# EAGLE design RCMega128 (EAGLE 4.11)
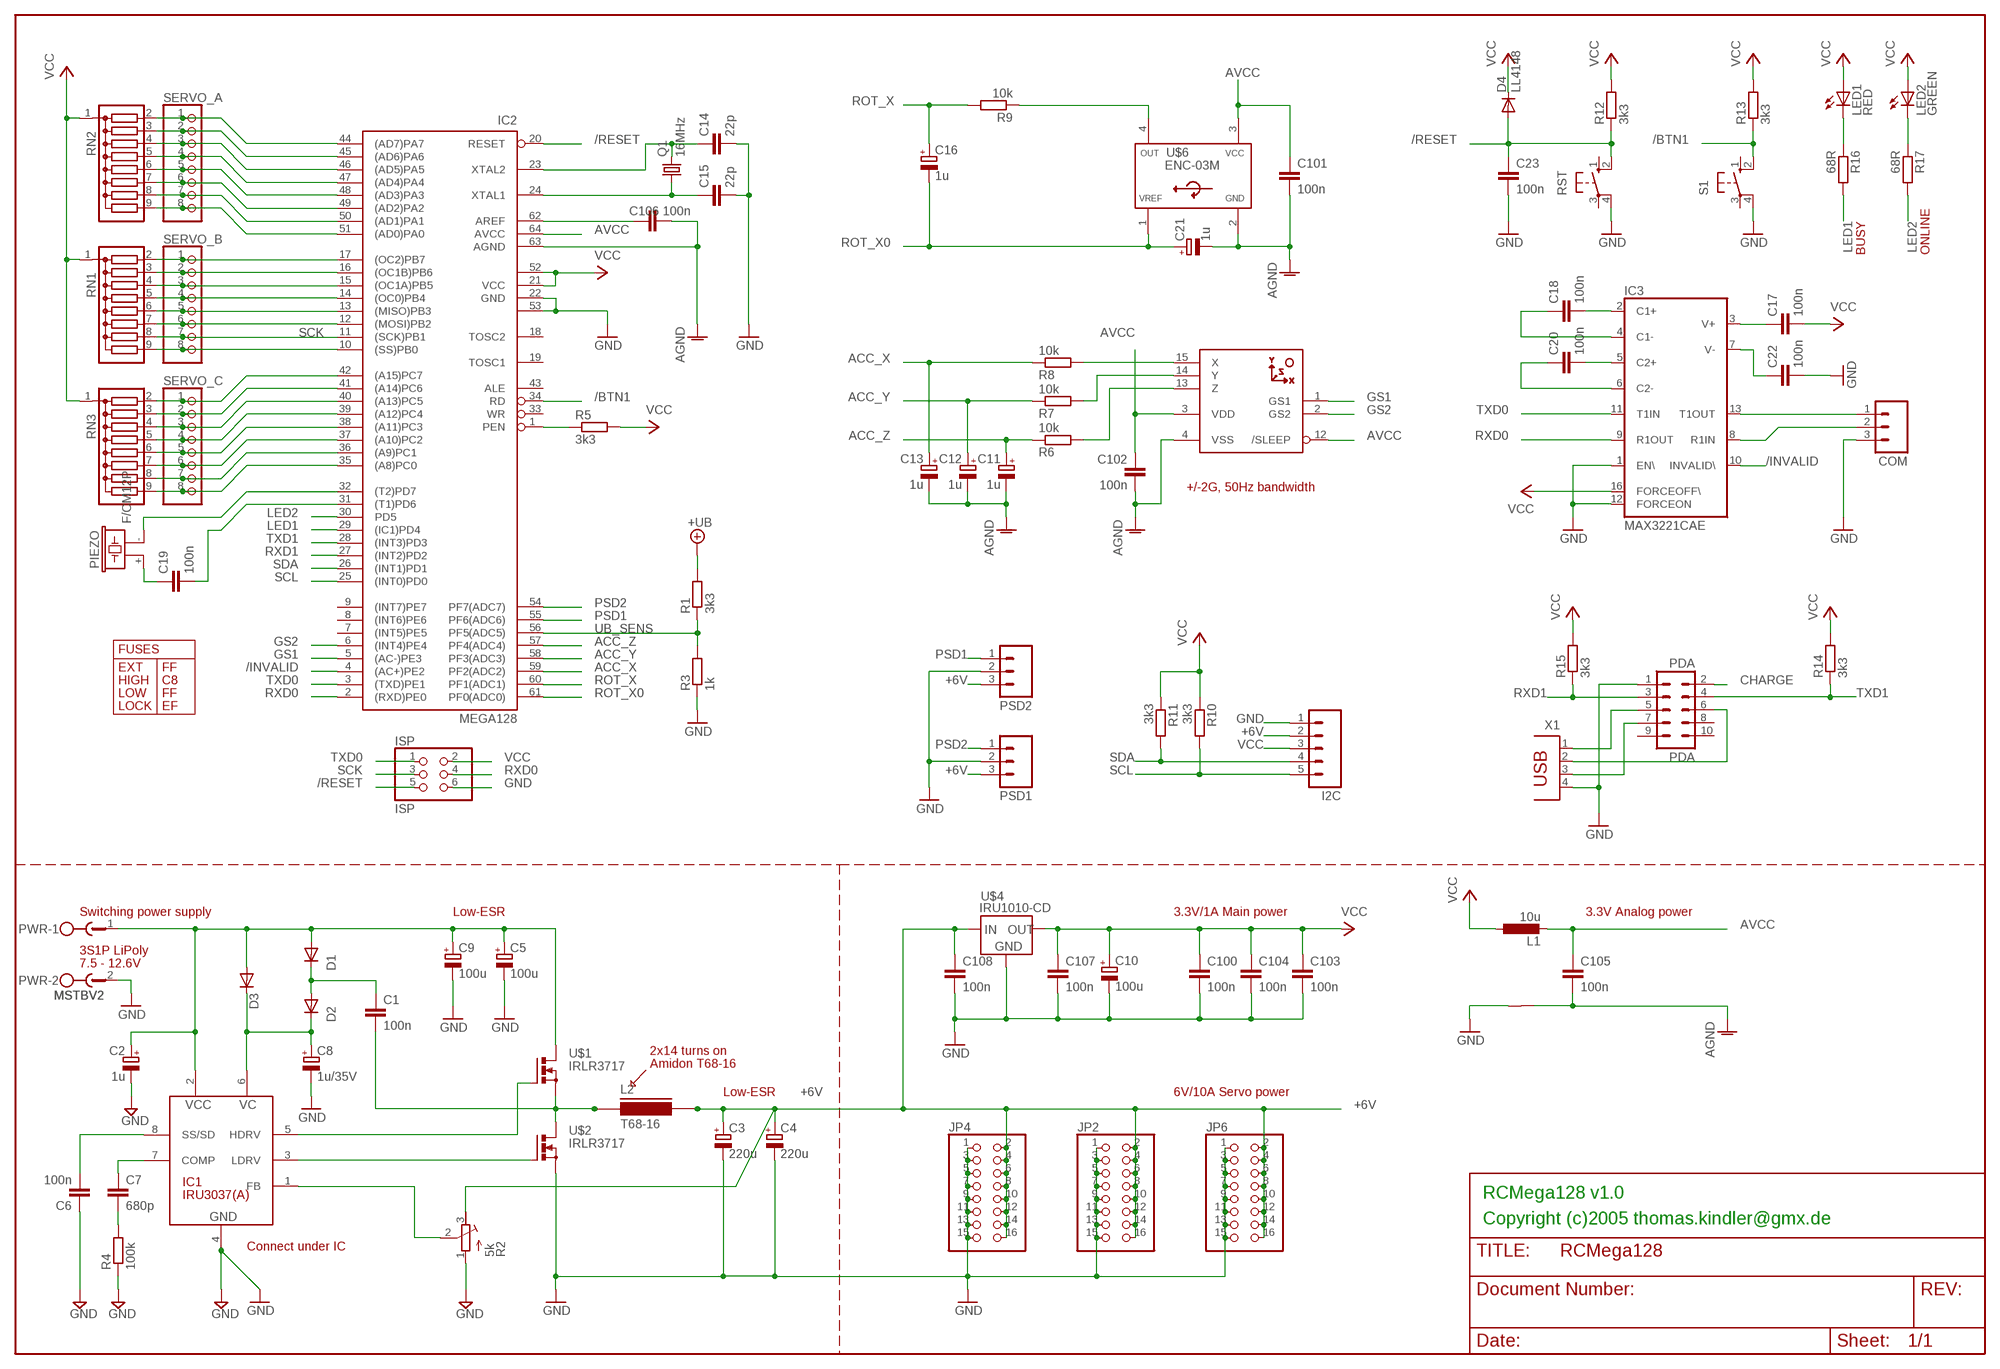
[diagram p0: schematic, sheet 1]

## Parts
C1  100n  C-EUC0805  [C0805]
C2  1u  CPOL-EUCT3528  [CT3528]
C3  220u  CPOL-EUD/7343-31R  [D/7343-31R]
C4  220u  CPOL-EUD/7343-31R  [D/7343-31R]
C5  100u  CPOL-EUD/7343-31R  [D/7343-31R]
C6  100n  C-EUC0805  [C0805]
C7  680p  C-EUC0805  [C0805]
C8  1u/35V  CPOL-EUCT3528  [CT3528]
C9  100u  CPOL-EUD/7343-31R  [D/7343-31R]
C10  100u  CPOL-EUD/7343-31R  [D/7343-31R]
C11  1u  CPOL-EUCT3528  [CT3528]
C12  1u  CPOL-EUCT3528  [CT3528]
C13  1u  CPOL-EUCT3528  [CT3528]
C14  22p  C-EUC0805  [C0805]
C15  22p  C-EUC0805  [C0805]
C16  1u  CPOL-EUCT3528  [CT3528]
C17  100n  C-EUC0805  [C0805]
C18  100n  C-EUC0805  [C0805]
C19  100n  C-EUC0805  [C0805]
C20  100n  C-EUC0805  [C0805]
C21  1u  CPOL-EUCT3528  [CT3528]
C22  100n  C-EUC0805  [C0805]
C23  100n  C-EUC0805  [C0805]
C100  100n  C-EUC0805  [C0805]
C101  100n  C-EUC0805  [C0805]
C102  100n  C-EUC0805  [C0805]
C103  100n  C-EUC0805  [C0805]
C104  100n  C-EUC0805  [C0805]
C105  100n  C-EUC0805  [C0805]
C106  100n  C-EUC0805  [C0805]
C107  100n  C-EUC0805  [C0805]
C108  100n  C-EUC0805  [C0805]
COM  M03  [03P]
D1  DIODE-SOD80C  [SOD80C]
D2  DIODE-SOD80C  [SOD80C]
D3  DIODE-SOD80C  [SOD80C]
D4  LL4148  DIODE-SOD80C  [SOD80C]
I2C  M05  [05P]
IC1  IRU3037(A)  [SO08]
IC2  MEGA128  MEGA103  [TQFP64]
IC3  MAX3221CAE  [SSOP16]
ISP  ISP  PINHD-2X3  [2X03]
JP2  PINHD-2X8  [2X08]
JP4  PINHD-2X8  [2X08]
JP6  PINHD-2X8  [2X08]
L1  10u  L-EUL2012C  [L2012C]
L2  T68-16  [T68-16]
LED1  RED  LEDCHIP-LED0805  [CHIP-LED0805]
LED2  GREEN  LEDCHIP-LED0805  [CHIP-LED0805]
PDA  PDA  ML10  [ML10]
PIEZO  F/CM12P  [F/CM12P]
PSD1  M03  [03P]
PSD2  M03  [03P]
PWR  MSTBV2  [MSTBV2]
Q1  16MHz  CRYTALHC49S  [HC49/S]
R1  3k3  R-EU_R0805  [R0805]
R2  5k  R-TRIMM5X  [RTRIM5X]
R3  1k  R-EU_R0805  [R0805]
R4  100k  R-EU_M0805  [M0805]
R5  3k3  R-EU_R0805  [R0805]
R6  10k  R-EU_R0805  [R0805]
R7  10k  R-EU_R0805  [R0805]
R8  10k  R-EU_R0805  [R0805]
R9  10k  R-EU_R0805  [R0805]
R10  3k3  R-EU_R0805  [R0805]
R11  3k3  R-EU_R0805  [R0805]
R12  3k3  R-EU_R0805  [R0805]
R13  3k3  R-EU_R0805  [R0805]
R14  3k3  R-EU_R0805  [R0805]
R15  3k3  R-EU_R0805  [R0805]
R16  68R  R-EU_R0805  [R0805]
R17  68R  R-EU_R0805  [R0805]
RN1  G08R  [SIL9]
RN2  G08R  [SIL9]
RN3  G08R  [SIL9]
RST  10-XX  [B3F-10XX]
S1  10-XX  [B3F-10XX]
SERVO_A  PINHD-1X8  [1X08]
SERVO_B  PINHD-1X8  [1X08]
SERVO_C  PINHD-1X8  [1X08]
U$1  IRLR3717  [D-PAK]
U$2  IRLR3717  [D-PAK]
U$4  IRU1010-CD  [D-PAK]
U$5  MMA7260Q  [16LEADQFN]
U$6  ENC-03M  [GYROSTAR]
U$100  0R  [0R]
X1  PN61729  [PN61729]

## Nets
+6V: C3.+ C4.+ C108.1 I2C.2 JP2.2 JP2.4 JP2.6 JP2.8 JP2.10 JP2.12 JP2.14 JP2.16 JP4.2 JP4.4 JP4.6 JP4.8 JP4.10 JP4.12 JP4.14 JP4.16 JP6.2 JP6.4 JP6.6 JP6.8 JP6.10 JP6.12 JP6.14 JP6.16 L2.P$1 L2.P$2 PSD1.3 PSD2.3 R2.3(A) U$4.3(IN)
+UB: C2.+ C5.+ C9.+ D1.A D3.A IC1.2(VCC) PWR.1 R1.2 U$1.4(D)
/BTN1: IC2.34(RD) R13.1 S1.2(S1)
/INVALID: IC2.4((AC+)PE2) IC3.10(INVALID\)
/RESET: C23.1 D4.A IC2.20(RESET) ISP.5 R12.1 RST.2(S1)
ACC_X: C13.+ IC2.59(PF2(ADC2)) R8.1
ACC_Y: C12.+ IC2.58(PF3(ADC3)) R7.1
ACC_Z: C11.+ IC2.57(PF4(ADC4)) R6.1
AGND: C11.- C12.- C13.- C21.- C101.2 C102.2 C105.2 C106.2 IC2.63(AGND) U$5.4(VSS) U$6.2(GND) U$100.P$2
AREF: C106.1 IC2.62(AREF)
AVCC: C101.1 C102.1 C105.1 IC2.64(AVCC) L1.2 U$5.3(VDD) U$5.12(/SLEEP) U$6.3(VCC)
CHARGE: PDA.2
GND: C2.- C3.- C4.- C5.- C6.1 C8.- C9.- C10.- C14.2 C15.2 C22.2 C23.2 C100.2 C103.2 C104.2 C107.2 C108.2 COM.3 I2C.1 IC1.4(GND) IC2.22(GND) IC2.53(GND1) IC3.1(EN\) IC3.12(FORCEON) ISP.6 JP2.1 JP2.3 JP2.5 JP2.7 JP2.9 JP2.11 JP2.13 JP2.15 JP4.1 JP4.3 JP4.5 JP4.7 JP4.9 JP4.11 JP4.13 JP4.15 JP6.1 JP6.3 JP6.5 JP6.7 JP6.9 JP6.11 JP6.13 JP6.15 PDA.1 PSD1.2 PSD2.2 PWR.2 R2.1(E) R3.1 R4.1 RST.4(P1) S1.4(P1) U$2.3(S) U$4.1(GND) U$100.P$1 X1.4
GS1: IC2.5((AC-)PE3) U$5.1(GS1)
GS2: IC2.6((INT4)PE4) U$5.2(GS2)
HDRV: IC1.5(HDRV) U$1.1(G)
LDRV: IC1.3(LDRV) U$2.1(G)
LED1: IC2.29((IC1)PD4) R16.2
LED2: IC2.30(PD5) R17.2
N$2: R6.2 U$5.13(Z)
N$3: R9.1 U$6.4(OUT)
N$4: LED1.C R16.1
N$5: LED2.C R17.1
N$6: C14.1 IC2.23(XTAL2) Q1.2
N$7: C15.1 IC2.24(XTAL1) Q1.1
N$10: C18.2 IC3.2(C1+)
N$11: C18.1 IC3.4(C1-)
N$12: C20.2 IC3.5(C2+)
N$13: C20.1 IC3.6(C2-)
N$14: C17.1 IC3.3(V+)
N$15: IC2.1(PEN) R5.1
N$16: C22.1 IC3.7(V-)
N$19: COM.1 IC3.13(T1OUT)
N$20: COM.2 IC3.8(R1IN)
N$23: R7.2 U$5.14(Y)
N$24: R8.2 U$5.15(X)
N$25: C1.2 L2.P$3 L2.P$4 U$1.3(S) U$2.4(D)
N$26: C19.1 PIEZO.+
N$29: IC2.32((T2)PD7) PIEZO.-
N$31: IC1.1(FB) R2.2(S)
N$32: C1.1 D1.C D2.A
N$33: C7.1 IC1.7(COMP)
N$35: C7.2 R4.2
N$37: C6.2 IC1.8(SS/SD)
N$38: C19.2 IC2.31((T1)PD6)
PSD1: IC2.55(PF6(ADC6)) PSD2.1
PSD2: IC2.54(PF7(ADC7)) PSD1.1
ROT_X: C16.+ IC2.60(PF1(ADC1)) R9.2
ROT_X0: C16.- C21.+ IC2.61(PF0(ADC0)) U$6.1(VREF)
RXD0: IC2.2((RXD)PE0) IC3.9(R1OUT) ISP.4
RXD1: IC2.27((INT2)PD2) PDA.3 R15.1
S0: IC2.44((AD7)PA7) RN2.2 SERVO_A.1
S1: IC2.45((AD6)PA6) RN2.3 SERVO_A.2
S2: IC2.46((AD5)PA5) RN2.4 SERVO_A.3
S3: IC2.47((AD4)PA4) RN2.5 SERVO_A.4
S4: IC2.48((AD3)PA3) RN2.6 SERVO_A.5
S5: IC2.49((AD2)PA2) RN2.7 SERVO_A.6
S6: IC2.50((AD1)PA1) RN2.8 SERVO_A.7
S7: IC2.51((AD0)PA0) RN2.9 SERVO_A.8
S8: IC2.17((OC2)PB7) RN1.2 SERVO_B.1
S9: IC2.16((OC1B)PB6) RN1.3 SERVO_B.2
S10: IC2.15((OC1A)PB5) RN1.4 SERVO_B.3
S11: IC2.14((OC0)PB4) RN1.5 SERVO_B.4
S12: IC2.12((MOSI)PB2) RN1.7 SERVO_B.6
S14: IC2.10((SS)PB0) RN1.9 SERVO_B.8
S15: IC2.13((MISO)PB3) RN1.6 SERVO_B.5
S16: IC2.42((A15)PC7) RN3.2 SERVO_C.1
S17: IC2.41((A14)PC6) RN3.3 SERVO_C.2
S18: IC2.40((A13)PC5) RN3.4 SERVO_C.3
S19: IC2.39((A12)PC4) RN3.5 SERVO_C.4
S20: IC2.37((A10)PC2) RN3.7 SERVO_C.6
S21: IC2.36((A9)PC1) RN3.8 SERVO_C.7
S22: IC2.35((A8)PC0) RN3.9 SERVO_C.8
S23: IC2.38((A11)PC3) RN3.6 SERVO_C.5
SCK: IC2.11((SCK)PB1) ISP.3 RN1.8 SERVO_B.7
SCL: I2C.5 IC2.25((INT0)PD0) R10.2
SDA: I2C.4 IC2.26((INT1)PD1) R11.2
TXD0: IC2.3((TXD)PE1) IC3.11(T1IN) ISP.1
TXD1: IC2.28((INT3)PD3) PDA.4 R14.1
UB_SENS: IC2.56(PF5(ADC5)) R1.1 R3.2
USB_D+: PDA.7 X1.3
USB_D-: PDA.6 X1.2
USB_VBUS: PDA.5 X1.1
VC: C8.+ D2.C D3.C IC1.6(VC)
VCC: C10.+ C17.2 C100.1 C103.1 C104.1 C107.1 D4.C I2C.3 IC2.21(VCC) IC2.52(VCC1) IC3.16(FORCEOFF\) ISP.2 L1.1 LED1.A LED2.A R5.2 R10.1 R11.1 R12.2 R13.2 R14.2 R15.2 RN1.1 RN2.1 RN3.1 U$4.4(OUT)
Unconnected: IC2.7((INT5)PE5) IC2.8((INT6)PE6) IC2.9((INT7)PE7) IC2.18(TOSC2) IC2.19(TOSC1) IC2.33(WR) IC2.43(ALE) PDA.8 PDA.9 PDA.10 RST.1(S) RST.3(P) S1.1(S) S1.3(P)

## Notes on the sheet
- ONLINE
- BUSY
- +/-2G, 50Hz bandwidth
- FUSES
- EXT | FF
- HIGH | C8
- LOW | FF
- LOCK | EF
- Switching power supply | Low-ESR | 3.3V/1A Main power | 3.3V Analog power
- 3S1P LiPoly
- 7.5 - 12.6V
- 2x14 turns on
- Amidon T68-16
- Low-ESR | 6V/10A Servo power
- RCMega128 v1.0
- Copyright (c)2005 thomas.kindler@gmx.de
- Connect under IC

## Power pins joined to a net without a drawn wire
GND: IC3.14(GND)
VCC: IC3.15(VCC)

## Library data of the parts
C1 C6 C7 C14 C15 C17-C20 C22 C23 C100-C108 = rcl:C-EU: CAPACITOR, European symbol
C2-C5 C8-C13 C16 C21 = rcl:CPOL-EU: POLARIZED CAPACITOR, European symbol
COM PSD1 PSD2 = con-amp-quick:M03: AMP QUICK CONNECTOR
D1-D4 = diode:DIODE-: DIODE
I2C = con-amp-quick:M05: AMP QUICK CONNECTOR
IC1 = special_parts:IRU3037(A)
IC2 = atmel:MEGA103*: MICROCONTROLLER Low-voltage (L) 128 Kbytes FLASH 4 Kbytes SRAM 2 Kbytes EEPROM UART RTC 8-channel 10 bit ADC
IC3 = maxim:MAX3221*: RS-232 Transceivers with AutoShutdown 1µA Supply-Current, True +3V to +5.5V http://dbserv.maxim-ic.com/
ISP = pinhead:PINHD-2X3: PIN HEADER
JP2 JP4 JP6 = pinhead:PINHD-2X8: PIN HEADER
L1 = rcl:L-EU: INDUCTOR, European symbol
L2 = special_parts:T68-16
LED1 LED2 = led:LED: LED OSRAM: - CHIPLED LG R971, LG N971, LY N971, LG Q971, LY Q971, LO R971, LY R971 LH N974, LH R974 LS Q976, LO Q976, LY Q976 LO Q996 - Hyper CHIPLED LW Q18S LB Q993, LB Q99A, LB R99A - SideLED LS A670, LO A670, LY A670, LG A670, LP A670 LB A673, LV A673, LT A673, LW A673 LH A674 LY A675 LS A676, LA A676, LO A676, LY A676, LW A676 LS A679, LY A679, LG A679 - Hyper Micro SIDELED® LS Y876, LA Y876, LO Y876, LY Y876 LT Y87S - SmartLED LW L88C, LW L88S LB L89C, LB L89S, LG L890 LS L89K, LO L89K, LY L89K LS L896, LA L896, LO L896, LY L896 - TOPLED LS T670, LO T670, LY T670, LG T670, LP T670 LSG T670, LSP T670, LSY T670, LOP T670, LYG T670 LG T671, LOG T671, LSG T671 LB T673, LV T673, LT T673, LW T673 LH T674 LS T676, LA T676, LO T676, LY T676, LB T676, LH T676, LSB T676, LW T676 LB T67C, LV T67C, LT T67C, LS T67K, LO T67K, LY T67K, LW E67C LS E67B, LA E67B, LO E67B, LY E67B, LB E67C, LV E67C, LT E67C LW T67C LS T679, LY T679, LG T679 LS T770, LO T770, LY T770, LG T770, LP T770 LB T773, LV T773, LT T773, LW T773 LH T774 LS E675, LA E675, LY E675, LS T675 LS T776, LA T776, LO T776, LY T776, LB T776 LHGB T686 LT T68C, LB T68C - Hyper Mini TOPLED® LB M676 - Mini TOPLED Santana® LG M470 LS M47K, LO M47K, LY M47K Source: http://www.osram.convergy.de/
PDA = con-harting-ml:ML10: HARTING
PIEZO = buzzer:F/CM12P: BUZZER Source: Buerklin
PWR = con-phoenix-508:MSTBV2: PHOENIX
Q1 = crystal:CRYTAL: CRYSTAL
R1 R3-R17 = rcl:R-EU_: RESISTOR, European symbol
R2 = rcl:R-TRIMM: Trimm resistor
RN1-RN3 = special_parts:G08R: SIL RESISTOR
RST S1 = switch-omron:10-XX: OMRON SWITCH
SERVO_A SERVO_B SERVO_C = pinhead_oct:PINHD-1X8: PIN HEADER
U$1 U$2 = special_parts:IRLR3717
U$4 = special_parts:IRU1010-CD
U$5 = special_parts:MMA7260Q
U$6 = special_parts:ENC-03M
U$100 = special_parts:0R
X1 = special_parts:PN61729: BERG USB connector

## Board
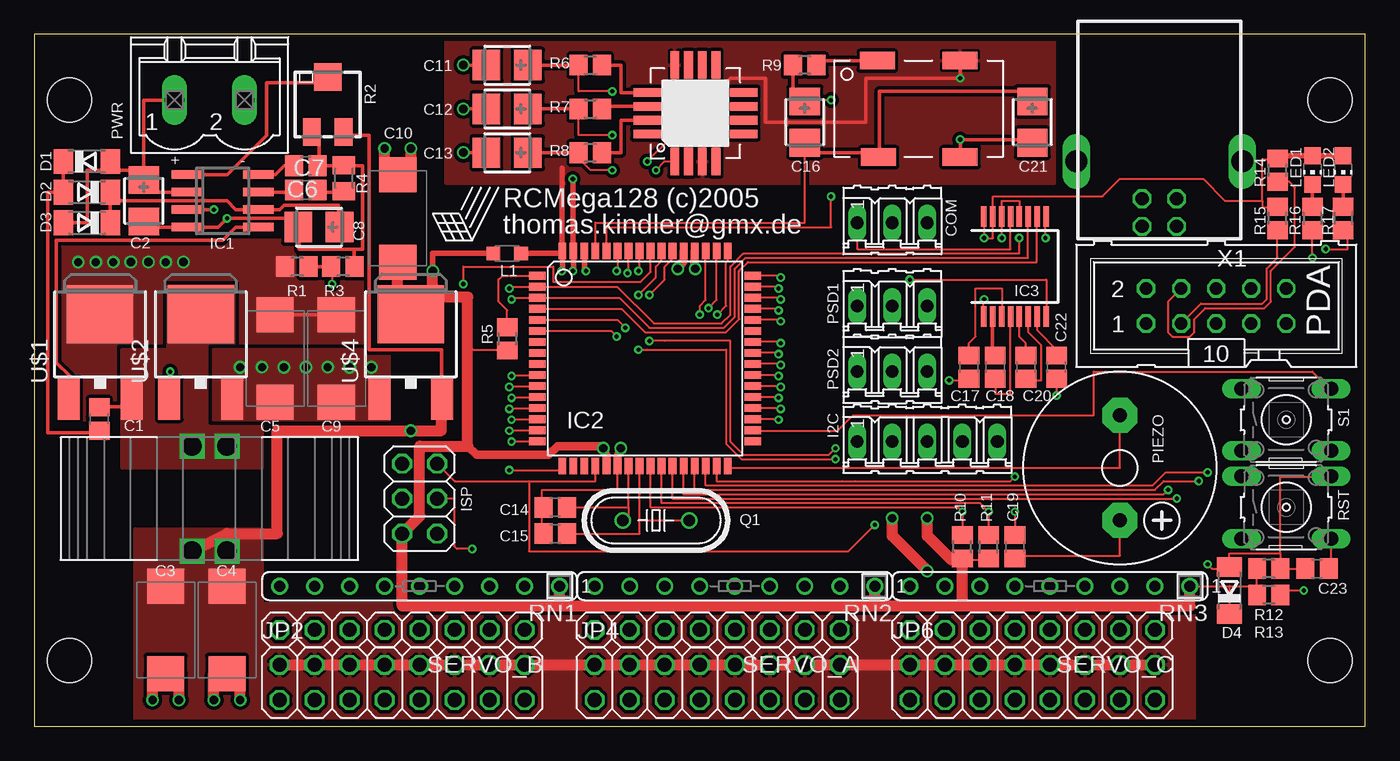
[diagram p1: board, top side]
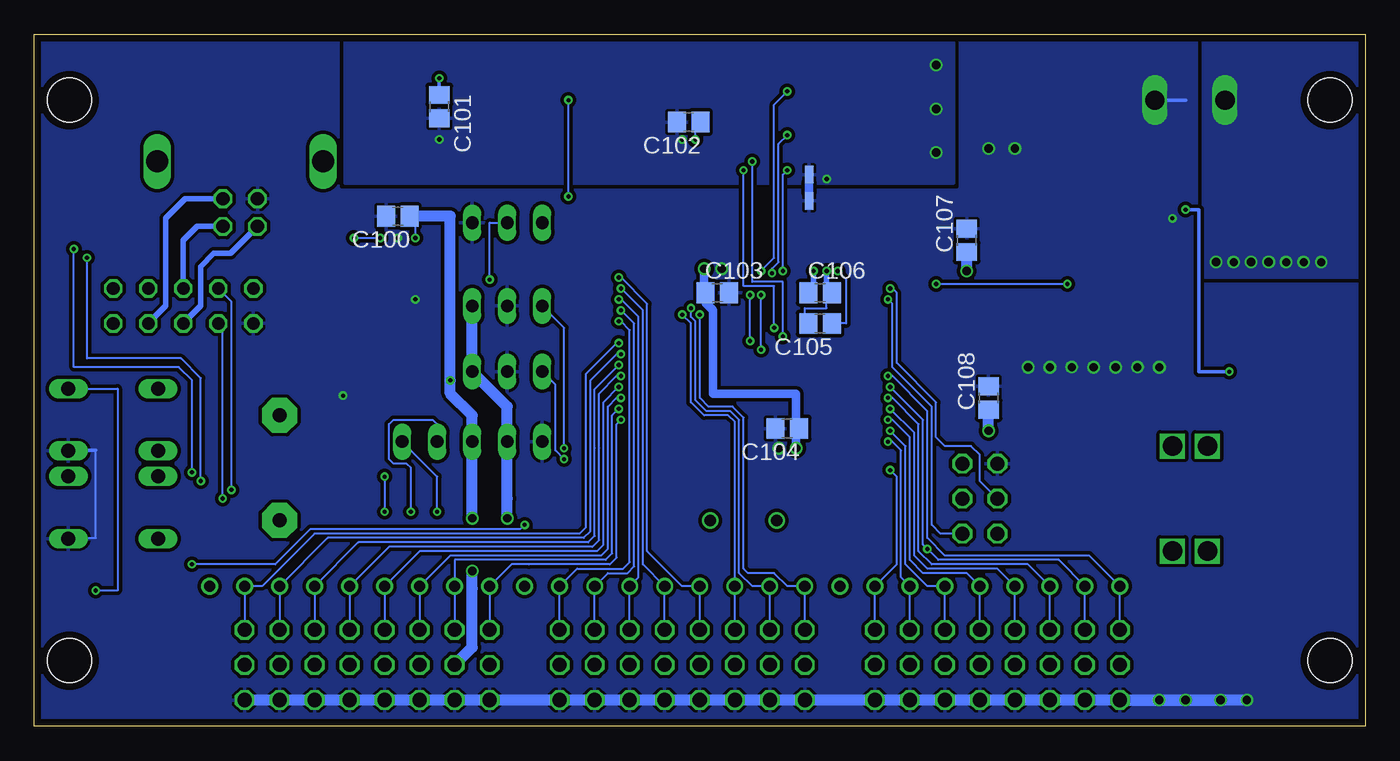
[diagram p2: board, bottom side, seen from below]

Size 96.52 x 50.16 mm. Coordinates in mm from the lower left corner, seen from the top.
Outline: 0,0 96.52,0 96.52,50.16 0,50.16 0,0
Copper layers (1*16): Top 0.035mm / dielectric 1.5mm / Bottom 0.035mm
Design rules "PCB-POOL": minimum track width 6mil, minimum drill 12mil, track to track 6mil, track to pad 6mil, pad to pad 6mil, via to via 6mil, smd to smd 6mil, copper to edge 20mil, drill to drill 8mil, minimum pad ring 8mil, minimum via ring 6mil, stop-mask expansion 3mil, vias tented up to drill 0mil, thermal gap 8mil
Holes 3.2 mm at 2.54,45.4 2.54,4.76 93.98,4.76 93.98,45.4

### Footprints (pad centres in the part's own frame; a part is rotated, then mirrored left to right if it is on the bottom)
C0805 = smd 1.3 x 1.5: 1 -0.85,0; 2 0.85,0
CT3528 = smd 2 x 2.2: + 1.5,0; - -1.5,0
D/7343-31R = smd 2.55 x 2.7: + 3.175,0; - -3.175,0
03P = drill 0.914 long: 1 -2.54,0; 2 0,0; 3 2.54,0
SOD80C = smd 1.4 x 1.8: A 1.7,0; C -1.7,0
05P = drill 0.914 long: 1 -5.08,0; 2 -2.54,0; 3 0,0; 4 2.54,0; 5 5.08,0
SO08 = smd 0.6 x 2.2: 1 -1.905,-2.6; 2 -0.635,-2.6; 3 0.635,-2.6; 4 1.905,-2.6; 5 1.905,2.6; 6 0.635,2.6; 7 -0.635,2.6; 8 -1.905,2.6
TQFP64 = smd 1.194 x 0.559: 1 -7.8,6; 2 -7.8,5.2; 3 -7.8,4.4; 4 -7.8,3.6; 5 -7.8,2.8; 6 -7.8,2; 7 -7.8,1.2; 8 -7.8,0.4; 9 -7.8,-0.4; 10 -7.8,-1.2; 11 -7.8,-2; 12 -7.8,-2.8; 13 -7.8,-3.6; 14 -7.8,-4.4; 15 -7.8,-5.2; 16 -7.8,-6; 33 7.8,-6; 34 7.8,-5.2; 35 7.8,-4.4; 36 7.8,-3.6; 37 7.8,-2.8; 38 7.8,-2; 39 7.8,-1.2; 40 7.8,-0.4; 41 7.8,0.4; 42 7.8,1.2; 43 7.8,2; 44 7.8,2.8; 45 7.8,3.6; 46 7.8,4.4; 47 7.8,5.2; 48 7.8,6 | smd 0.559 x 1.194: 17 -6,-7.8; 18 -5.2,-7.8; 19 -4.4,-7.8; 20 -3.6,-7.8; 21 -2.8,-7.8; 22 -2,-7.8; 23 -1.2,-7.8; 24 -0.4,-7.8; 25 0.4,-7.8; 26 1.2,-7.8; 27 2,-7.8; 28 2.8,-7.8; 29 3.6,-7.8; 30 4.4,-7.8; 31 5.2,-7.8; 32 6,-7.8; 49 6,7.8; 50 5.2,7.8; 51 4.4,7.8; 52 3.6,7.8; 53 2.8,7.8; 54 2,7.8; 55 1.2,7.8; 56 0.4,7.8; 57 -0.4,7.8; 58 -1.2,7.8; 59 -2,7.8; 60 -2.8,7.8; 61 -3.6,7.8; 62 -4.4,7.8; 63 -5.2,7.8; 64 -6,7.8
SSOP16 = smd 0.4 x 1.5: 1 -2.275,-3.625; 2 -1.625,-3.625; 3 -0.975,-3.625; 4 -0.325,-3.625; 5 0.325,-3.625; 6 0.975,-3.625; 7 1.625,-3.625; 8 2.275,-3.625; 9 2.275,3.625; 10 1.625,3.625; 11 0.975,3.625; 12 0.325,3.625; 13 -0.325,3.625; 14 -0.975,3.625; 15 -1.625,3.625; 16 -2.275,3.625
2X03 = drill 1.016 octagon: 1 -2.54,-1.27; 2 -2.54,1.27; 3 0,-1.27; 4 0,1.27; 5 2.54,-1.27; 6 2.54,1.27
2X08 = drill 1.016 octagon: 1 -8.89,-1.27; 2 -8.89,1.27; 3 -6.35,-1.27; 4 -6.35,1.27; 5 -3.81,-1.27; 6 -3.81,1.27; 7 -1.27,-1.27; 8 -1.27,1.27; 9 1.27,-1.27; 10 1.27,1.27; 11 3.81,-1.27; 12 3.81,1.27; 13 6.35,-1.27; 14 6.35,1.27; 15 8.89,-1.27; 16 8.89,1.27
L2012C = smd 1 x 1: 1 -1,0; 2 1,0
T68-16 = drill 1.4 square: P$1 -3.81,1.27; P$2 -3.81,-1.27; P$3 3.81,1.27; P$4 3.81,-1.27
CHIP-LED0805 = smd 1.2 x 1.2: A 0,-1.05; C 0,1.05
ML10 = drill 0.914 octagon: 1 -5.08,-1.27; 2 -5.08,1.27; 3 -2.54,-1.27; 4 -2.54,1.27; 5 0,-1.27; 6 0,1.27; 7 2.54,-1.27; 8 2.54,1.27; 9 5.08,-1.27; 10 5.08,1.27
F/CM12P = drill 1.016 pad 2.54 octagon: + 3.81,0; - -3.81,0
MSTBV2 = drill 1.397 long: 1 -2.54,0; 2 2.54,0
HC49/S = drill 0.813 round: 1 -2.413,0; 2 2.413,0
R0805 = smd 1.3 x 1.5: 1 -0.85,0; 2 0.85,0
RTRIM5X = smd 1.3 x 2: 1 -1.15,-2; 3 1.15,-2 | smd 2 x 2: 2 0,2
M0805 = smd 1.3 x 1.6: 1 -0.95,0; 2 0.95,0
SIL9 = drill 0.813 round: 1 -10.16,0; 2 -7.62,0; 3 -5.08,0; 4 -2.54,0; 5 0,0; 6 2.54,0; 7 5.08,0; 8 7.62,0; 9 10.16,0
B3F-10XX = drill 1.016 long: 1 -3.251,2.261; 2 3.251,2.261; 3 -3.251,-2.261; 4 3.251,-2.261
1X08 = drill 1.016 octagon: 1 -8.89,0; 2 -6.35,0; 3 -3.81,0; 4 -1.27,0; 5 1.27,0; 6 3.81,0; 7 6.35,0; 8 8.89,0
D-PAK = smd 1.6 x 3: 1 -2.28,-4.04; 3 2.28,-4.04 | smd 4.826 x 4.191: 4 0,2.096
16LEADQFN = smd 2 x 0.635: 1 -3.5,1.5; 2 -3.5,0.5; 3 -3.5,-0.5; 4 -3.5,-1.5; 9 3.5,-1.5; 10 3.5,-0.5; 11 3.5,0.5; 12 3.5,1.5 | smd 0.635 x 2: 5 -1.5,-3.5; 6 -0.5,-3.5; 7 0.5,-3.5; 8 1.5,-3.5; 13 1.5,3.5; 14 0.5,3.5; 15 -0.5,3.5; 16 -1.5,3.5
GYROSTAR = smd 2.54 x 1.27: 1 -2.9,-3.5; 2 3,-3.5; 3 3,3.5; 4 -3,3.5
0R = smd 1.27 x 0.635: P$1 -0.953,0; P$2 0.953,0
PN61729 = drill 0.95 octagon: 1 1.25,4.71; 2 -1.25,4.71; 3 -1.25,2.71; 4 1.25,2.71 | drill 1.6 long: P$1 -6.032,0; P$2 6.033,0

### Placement (x,y rotation side)
C1  4.71,22.28 90 top
C2  7.94,38.1 90 top
C3  9.53,6.99 90 top
C4  13.97,6.99 90 top
C5  17.46,26.67 90 top
C6  19.68,40.64 180 top
C7  19.68,38.89 0 top
C8  20.64,36.2 0 top
C9  21.91,26.67 90 top
C10  26.35,36.83 270 top
C11  34.29,47.94 0 top
C12  34.29,44.77 0 top
C13  34.29,41.59 0 top
C14  37.78,15.88 180 top
C15  37.78,13.97 180 top
C16  55.88,43.81 90 top
C17  67.79,26.04 270 top
C18  69.69,26.04 90 top
C19  71.12,13.02 90 top
C20  71.91,26.04 90 top
C21  72.39,43.81 90 top
C22  74.14,26.04 270 top
C23  93.03,11.43 0 top
C100  70.17,36.99 180 bottom
C101  67.15,44.93 270 bottom
C102  49.05,43.81 180 bottom
C103  46.99,31.43 0 bottom
C104  41.91,21.59 180 bottom
C105  39.53,29.21 180 bottom
C106  39.53,31.43 0 bottom
C107  28.89,35.24 90 bottom
C108  27.31,23.81 90 bottom
COM  62.23,36.51 0 top
D1  3.8,40.96 0 top
D2  3.81,38.73 180 top
D3  3.81,36.51 180 top
D4  86.68,9.84 90 top
I2C  64.77,20.64 0 top
IC1  13.65,38.1 270 top
IC2  44.29,26.67 0 top
IC3  71.12,33.34 0 top
ISP  27.94,16.51 90 top
JP2  26.67,3.17 0 top
JP4  49.53,3.17 0 top
JP6  72.39,3.17 0 top
L1  34.29,34.29 0 top
L2  12.7,16.51 90 top
LED1  92.71,40.32 180 top
LED2  94.93,40.32 180 top
PDA  85.72,30.48 0 top
PIEZO  78.74,18.73 270 top
PSD1  62.23,30.48 0 top
PSD2  62.23,25.72 0 top
PWR  12.7,45.4 0 top
Q1  45.09,14.92 180 top
R1  19.05,33.34 180 top
R2  21.27,45.09 0 top
R3  22.38,33.34 180 top
R4  22.45,39.74 270 top
R5  34.29,28.1 270 top
R6  40.32,47.94 0 top
R7  40.32,44.77 0 top
R8  40.32,41.59 0 top
R9  55.88,47.94 180 top
R10  67.31,13.02 90 top
R11  69.22,13.02 90 top
R12  89.53,11.43 180 top
R13  89.53,9.53 180 top
R14  90.17,40.32 90 top
R15  90.17,36.83 90 top
R16  92.71,36.83 270 top
R17  94.93,36.83 270 top
RN1  27.94,10.16 180 top
RN2  50.8,10.16 180 top
RN3  73.66,10.16 180 top
RST  90.81,15.88 0 top
S1  90.81,22.23 0 top
SERVO_A  49.53,6.99 180 top
SERVO_B  26.67,6.99 180 top
SERVO_C  72.39,6.99 180 top
U$1  4.76,27.78 0 top
U$2  12.06,27.78 0 top
U$4  27.3,27.78 0 top
U$5  47.94,44.45 90 top
U$6  64.14,44.77 0 top
U$100  40.32,39.05 90 bottom
X1  81.6,40.96 180 top

### Tracks (layer width: path | path; a pad name or v marks a point on that pad's centre or on a via)
+6V  (via drill 0.61)
  Top 0.254: 13.97,9.84 C4.+ | U$4.3 29.53,23.58 29.53,27.3 26.35,27.3 | 26.35,27.3 | 26.35,27.3 24.29,27.3 24.29,42.86 22.54,42.86 22.54,43.09 R2.3
  Top 0.406: 29.53,23.74 U$4.3
  Top 0.813: JP2.2 JP2.4 JP2.6 JP2.8 | JP2.8 25.72,4.45 | JP2.8 JP2.10 JP2.12 JP2.14 JP2.16 JP4.2 JP4.4 JP4.6 JP4.8 JP4.10 JP4.12 JP4.14 JP4.16 JP6.2 JP6.4 JP6.6 JP6.8 | JP6.8 71.44,4.45 | JP6.8 JP6.10 JP6.12 JP6.14 JP6.16 | L2.P$1 13.97,13.97 17.62,13.97 17.62,21.43 v27.3,21.43 29.53,21.43 29.53,23.74 | v64.77,11.27 62.23,13.81 v62.23,15.08
  Bottom 0.813: PSD1.3 PSD2.3 62.23,23.18 I2C.2 62.23,16.51 v62.23,15.08 | 64.77,10 64.77,5.71 JP6.4 | 64.77,10 | 64.77,10 v64.77,11.27 | C108.1 | v27.3,21.43 C108.1
  pour Top (isolate 0.254, no thermals): 7.3,14.29 16.51,14.29 16.51,0 7.3,0
  pour Top (isolate 0.254): 16.51,8.89 84.14,8.89 84.14,0 16.51,0
+UB  (via drill 0.6, 0.61)
  Top 0.254: IC1.2 7.94,38.73 C2.+ 7.94,40.32 | 5.71,40.96 D1.A 5.5,40.43 5.4,40.32 | 5.4,40.32 3.81,40.32 3.81,36.51 D3.A | 5.4,40.32 7.94,40.32 | C9.+ C5.+ 16.51,29.84 | U$1.4 4.16,29.88 4.45,29.84 | 7.94,40.32 7.94,45.4 PWR.1
  other vias: 6.99,33.66 8.26,33.66 10.79,33.66 3.17,33.66 4.45,33.66 5.71,33.66 9.53,33.66
  pour Top (isolate 0.254, rank 6, no thermals): 0,35.24 23.81,35.24 23.81,22.23 0,22.23
  pour Bottom (isolate 0.254, rank 2, no thermals): 11.75,50.16 11.75,32.54 0,32.54 0,50.16
/BTN1  (via drill 0.3)
  Top 0.152: R13.1 90.39,9.84 v92.08,9.84 | IC2.34 52.19,21.47 52.39,21.43 58.26,21.43 58.74,21.91 59.37,22.54 76.83,22.54 76.83,25.72 92.71,25.72 93.98,24.49 | 93.98,24.49 93.98,24.45 | 93.98,24.49 S1.2
  Bottom 0.152: S1.2 90.49,24.49 90.49,9.84 v92.08,9.84
/INVALID
  Top 0.152: 51.12,33.02 51.75,33.66 72.71,33.66 72.71,34.29 72.71,36.51 IC3.10 | 51.12,33.02 | 51.12,33.02 51.12,29.53 50.16,28.57 44.29,28.57 42.6,30.27 IC2.4
/RESET  (via drill 0.3)
  Top 0.152: RST.2 94.06,18.1 90.39,18.1 90.39,12.54 | IC2.20 40.69,17.78 35.88,17.78 | 35.88,17.78 30.48,17.78 ISP.5 | C23.1 R12.1 90.39,12.54 | v60.96,14.61 59.05,12.7 35.88,12.7 35.88,17.78 | v85.09,11.75 85.41,11.43 86.68,11.43 D4.A 86.68,12.54 90.39,12.54
  Bottom 0.152: v60.96,14.61 61.28,14.29 76.52,14.29 79.06,11.75 v85.09,11.75
ACC_X  (via drill 0.3)
  Top 0.152: IC2.59 42.29,33.08 v42.23,33.02 | v41.91,40.32 40.32,40.32 39.47,41.17 R8.1
  Top 0.254: 35.56,41.59 C13.+ R8.1
  Bottom 0.152: v42.23,33.02 42.23,40.01 v41.91,40.32
ACC_Y  (via drill 0.3)
  Top 0.152: IC2.58 43.09,32.95 v43.02,32.86 | R7.1 39.47,42.86 v41.91,42.86
  Top 0.254: R7.1 C12.+
  Bottom 0.152: v43.02,32.86 43.02,33.18 42.55,33.66 42.55,42.23 v41.91,42.86
ACC_Z  (via drill 0.3)
  Top 0.152: IC2.57 43.89,33.1 v43.81,33.02 | R6.1 39.47,46.04 v41.91,46.04
  Top 0.254: 35.56,47.94 C11.+ R6.1
  Bottom 0.152: v41.91,46.04 42.86,45.09 42.86,33.97 v43.81,33.02 | v43.81,33.02
AGND  (via drill 0.3, 0.61)
  Top 0.254: 32.79,44.68 C12.- v31.11,44.77 | C11.- v31.11,47.94 | C13.- v31.11,41.59 | U$5.4 49.44,42.46 v49.53,42.55 | 67.16,41.27 67.31,41.27 | C21.- 72.39,42.55 v67.15,42.55 67.16,42.38 67.16,41.27 | 67.31,41.27 67.3,41.27 67.16,41.27 | U$6.2 67.16,41.27 | v39.05,33.02 39.09,33.06
  Top 0.406: C12.- 32.7,44.77 32.79,44.85 | C13.- 32.7,41.59 32.79,41.68 | 39.09,33.06 IC2.63 39.05,34.51 v39.05,39.69
  Bottom 0.152: C105.2 40.64,29.21 40.64,30.32 39.05,30.32 39.05,31.43 C106.2 39.05,31.81
  Bottom 0.406: 39.05,31.81 v39.05,33.02
  pour Bottom (isolate 0.254): 29.84,50.16 29.84,39.37 73.98,39.37 73.98,50.16
AREF  (via drill 0.3)
  Top 0.406: IC2.62 39.89,33.13 v40.01,33.02
  Bottom 0.152: C106.1 40.01,31.81
  Bottom 0.406: 40.01,31.81 v40.01,33.02
AVCC  (via drill 0.3)
  Top 0.152: 38.24,34.47 38.26,34.49
  Top 0.254: U$5.12 46.35,47.95 46.35,46.35 48.58,46.35 | 48.58,46.35 v48.58,42.55 48.58,40.95 U$5.3 48.42,40.95 | 48.58,46.35 49.85,46.35 50.48,46.99 53.02,46.99 53.02,43.81 60.33,43.81 60.33,46.99 v67.15,46.99 U$6.3 67.3,48.27 U$6.3 | IC2.64 38.24,34.47
  Top 0.406: v38.26,33.02 38.29,33.05 IC2.64 38.11,34.29 L1.2 | 38.26,34.49 38.26,40.48
  Bottom 0.152: v48.58,42.55 48.58,43.18 C102.1 | 67.15,45.72 C101.1 | 67.15,45.72 | C105.1 37.62,29.21 37.62,32.38 v38.26,33.02
  Bottom 0.254: v67.15,46.99 67.15,45.72
  pour Top (isolate 0.254): 29.84,50.16 29.84,39.37 73.98,39.37 73.98,50.16
GND  (via drill 0.3, 0.6, 0.61)
  Top 0.152: C22.2 v74.14,23.97 | C15.2 36.83,13.65 | 36.83,13.65 36.83,16.19 | 36.83,16.19 C14.2 | 36.83,16.19 36.83,17.14 42.29,17.14 IC2.22 | 36.83,13.65 36.51,13.97 | 93.66,11.75 C23.2 94.06,11.75 RST.4 | IC3.1 68.84,30.85 v68.9,30.96 | IC3.14 70.17,36.96 v70.17,35.4 70.17,38.1 71.44,38.1 71.44,36.83 71.44,36.96 IC3.12
  Top 0.254: C2.- 7.94,36.2 IC1.4 13.34,36.2 v13.97,36.83 18.57,36.83 C8.- 19.21,35.24 19.21,34.61 23.18,34.61 | 20.54,42.55 20.64,42.55 | R2.1 20.12,42.55 20.54,42.55 | 20.54,42.55 20.48,42.39 20.64,42.39 20.64,40.64 | U$2.3 14.35,23.55 14.29,23.5 | 23.18,34.61 23.81,34.61 23.81,40.64 22.54,40.64 | 23.18,34.61 23.18,33.66 | 22.54,40.64 22.49,40.7 R4.1 22.54,40.7 22.54,40.64 | 22.54,40.64 20.64,40.64 | 20.64,40.64 C6.1 | 71.44,36.83 IC3.12 | 22.23,23.23 22.23,23.5 C9.- | U$4.1 24.77,23.58 24.77,23.18 | 25.4,40.01 C10.- 27.3,40.01
  Top 0.406: R3.1 23.18,33.34 23.18,33.66 | 8.57,3.81 C3.- 10.48,3.81 | 13.02,3.81 C4.- 14.92,3.81 | v42.55,20.16
  Top 0.61: IC2.22 42.29,19.59 v42.55,20.16 | v46.67,33.18 | IC2.53 47.09,33.76 v46.67,33.18
  Top 0.813: v8.57,1.91 8.57,3.81 | v13.02,1.91 13.02,3.81 | 10.48,3.81 v10.48,1.91 | v14.92,1.91 14.92,3.81 | 25.4,40.01 v25.4,41.91 | 27.3,40.01 v27.3,41.91
  Bottom 0.152: RST.4 94.06,13.65 92.08,13.65 92.08,20
  Bottom 0.254: 13.02,45.4 PWR.2 | S1.4 94.06,20 92.08,20
  Bottom 0.813: JP2.1 v14.92,1.91 | v14.92,1.91 v13.02,1.91 | v14.92,1.91 v10.48,1.91 | v8.57,1.91 JP2.1 | JP2.1 JP2.3 JP2.5 25.08,1.91 | 25.08,1.91 JP2.7 | 25.08,1.91 JP2.9 JP2.11 JP2.13 JP2.15 JP4.1 JP4.3 | JP4.3 43.5,1.91 | JP4.3 JP4.5 JP4.7 JP4.9 JP4.11 JP4.13 | JP4.13 56.2,1.91 | JP4.13 JP4.15 JP6.1 JP6.3 JP6.5 JP6.7 JP6.9 JP6.11 JP6.13 | JP6.13 79.06,1.91 | JP6.13 JP6.15
  other vias: 14.92,26.04 18.1,26.04 22.86,26.04 19.68,26.04 16.51,26.04 21.27,26.04 24.45,26.04
  pour Bottom (isolate 0.254, rank 6): 0,50.16 0,0 96.52,0 96.52,50.16
  pour Top (isolate 0.254, no thermals): 13.02,27.3 25.72,27.3 25.72,22.23 13.02,22.23
  pour Bottom (no thermals): 12.38,48.26 17.78,48.26 17.78,42.55 12.38,42.55
GS1  (via drill 0.3)
  Top 0.152: U$5.1 46.36,40.95 46.35,40.96 45.72,40.96 v45.09,40.32 | IC2.5 42.28,29.47 v42.86,28.89
  Bottom 0.152: v45.09,40.32 45.09,31.91 42.86,31.91 v42.86,28.89
GS2  (via drill 0.3)
  Top 0.152: v44.45,40.96 45.88,42.39 47.31,42.39 47.31,40.64 47.44,40.77 U$5.2 | IC2.6 41.81,28.67 v42.23,28.26
  Bottom 0.152: 44.45,32.23 44.45,33.02 | v44.45,40.96 | 44.45,32.23 42.23,32.23 42.23,29.37 v42.23,28.26 | 44.45,33.02 v44.45,40.96 | 44.45,32.23 44.45,33.02
HDRV
  Top 0.254: IC1.5 14.61,36.2 13.65,35.24 1.59,35.24 1.59,26.35 2.54,25.4 2.54,23.81 | 2.54,23.81 2.48,23.75 U$1.1 2.48,23.81 2.54,23.81
LDRV  (via drill 0.3)
  Top 0.254: v13.02,37.47 IC1.3 10.48,37.47 | 9.84,25.08 10.16,25.08 U$2.1 | 9.84,25.08 9.84,24.77 | 9.84,25.08 v9.84,25.72
  Bottom 0.254: v9.84,25.72 12.06,25.72 12.06,37.47 v13.02,37.47
LED1  (via drill 0.3)
  Top 0.152: IC2.29 47.89,17.14 58.9,17.14 59.85,17.14 81.28,17.14 81.92,17.78 v84.45,17.78 | R16.2 92.92,35.98 93.03,35.88 92.71,35.56 v92.71,33.97
  Bottom 0.152: v84.45,17.78 84.45,25.24 85.88,26.67 92.71,26.67 v92.71,33.97
LED2  (via drill 0.3)
  Top 0.152: IC2.30 48.69,17.46 81.12,17.46 82.07,18.41 v85.09,18.41 | R17.2 95.15,35.98 95.25,35.88 95.25,34.61 v93.66,34.61
  Bottom 0.152: v85.09,18.41 85.09,25.08 86.04,26.04 93.66,26.04 v93.66,34.61
N$2
  Top 0.254: U$5.13 42.55,45.95 42.55,47.94 R6.2 40.96,47.94
N$3
  Top 0.254: R9.1 57.15,47.94 57.15,48.27 U$6.4
N$4
  Top 0.254: R16.1 LED1.C
N$5
  Top 0.254: R17.1 LED2.C
N$6
  Top 0.152: C14.1 42.86,15.88 | 42.86,15.88 43.09,15.88 | 43.09,15.88 43.09,15.15 42.86,14.92 Q1.2 | 43.09,15.88 IC2.23 | 42.86,15.88 43.09,15.88
N$7
  Top 0.152: IC2.24 43.89,16.83 43.89,14.92 | 43.89,14.92 43.89,13.97 C15.1 | 43.89,14.92 Q1.1
N$10
  Top 0.254: 69.69,26.99 69.85,26.99 | C18.2 69.69,26.99 | IC3.2 69.5,26.99 69.69,26.99
N$11
  Top 0.152: C18.1 69.69,24.13 70.8,24.13 IC3.4
N$12
  Top 0.152: C20.2 71.91,27.78 71.44,28.26 IC3.5
  Top 0.254: C20.2 71.91,26.67
N$13
  Top 0.152: IC3.6 72.09,28.57 73.03,27.62 73.03,25.08 71.91,25.08
  Top 0.254: C20.1 71.91,25.08
N$14
  Top 0.152: C17.1 67.79,27.78 68.26,28.26 68.26,31.75 70.17,31.75 70.17,29.53
  Top 0.254: 70.17,29.53 70.14,29.55 IC3.3
N$15
  Top 0.152: IC2.1 33.94,32.67 33.66,32.38 33.66,30.8 34.29,30.16 R5.1
N$16
  Top 0.152: IC3.7 72.75,28.73 74.14,27.3 C22.1
N$19
  Top 0.152: COM.1 59.69,34.61 70.8,34.61 IC3.13
N$20  (via drill 0.3)
  Top 0.152: IC3.8 73.39,32.38 v63.5,32.38
  Bottom 0.152: v63.5,32.38 63.5,36.51 COM.2
N$23
  Top 0.254: R7.2 41.27,44.77 41.27,44.95 U$5.14
N$24
  Top 0.254: U$5.15 42.55,43.95 42.55,41.59 R8.2 40.96,41.59
N$25
  Top 0.254: 6.99,23.74 U$1.3 6.99,24.13 6.99,23.18 4.71,23.18 C1.2
  pour Top (isolate 0.254, rank 2, no thermals): 14.45,31.91 14.45,27.3 13.02,27.3 13.02,22.23 16.51,22.23 16.51,18.73 6.35,18.73 6.35,27.3 9.68,27.3 9.68,31.91
N$26
  Top 0.152: C19.1 71.12,12.38 78.74,12.38 PIEZO.+
N$29
  Top 0.152: PIEZO.- 78.74,18.73 50.29,18.73 IC2.32
N$31
  Top 0.254: 10.79,40.01 IC1.1 13.97,40.01 16.83,42.86 16.83,46.67 21.91,46.67 R2.2 21.91,46.99
N$32
  Top 0.254: 2.07,40.96 D1.C D2.A | D2.A 2.22,38.73 | C1.1 4.76,21.43 4.76,21.27 0.95,21.27 0.95,38.73 D2.A
N$33
  Top 0.254: IC1.7 18.84,38.73 C7.1
N$35
  Top 0.254: R4.2 22.45,38.73 20.54,38.73 C7.2
N$37
  Top 0.254: C6.2 18.1,40.64 17.46,40.01 IC1.8
N$38  (via drill 0.3)
  Top 0.152: IC2.31 49.49,17.78 58.58,17.78 59.53,17.78 70.8,17.78 v71.12,18.1 | 71.12,13.97 | 71.12,13.97 C19.2 | v71.12,15.56 71.12,13.97
  Bottom 0.152: v71.12,18.1 v71.12,15.56
PSD1  (via drill 0.3)
  Top 0.152: v43.81,27.3 44.45,27.3 50.16,27.3 50.16,20.48 51.28,19.37 v58.1,19.37 | IC2.55 45.49,33.74 45.09,33.34 45.09,32.54 44.45,31.91 v43.81,31.27
  Bottom 0.152: v43.81,27.3 v43.81,31.27 | v58.1,19.37 58.74,20 58.74,24.77 PSD2.1
PSD2  (via drill 0.3)
  Top 0.152: v44.61,27.94 45.72,27.94 50.48,27.94 50.48,20.64 51.44,19.68 57.63,19.68 v58.1,20.16 | IC2.54 46.29,33.91 45.72,33.34 45.72,32.38 v44.61,31.27
  Bottom 0.152: v44.61,27.94 v44.61,31.27 | v58.1,20.16 58.1,28.89 PSD1.1
ROT_X  (via drill 0.3)
  Top 0.152: IC2.60 41.49,36.2 57.78,36.2 v57.78,38.42 | v57.78,45.4 55.88,45.4 | 55.88,45.4 C16.+ | 55.88,45.4 55.03,45.4
  Top 0.254: 55.03,45.4 R9.2
  Bottom 0.152: v57.78,38.42 v57.78,45.4
ROT_X0
  Top 0.152: IC2.61 40.69,36.51 55.88,36.51 55.88,41.59
  Top 0.254: U$6.1 61.28,41.27 61.28,41.59 | C16.- 55.88,41.59 61.28,41.59 | 61.28,41.59 61.28,46.04 72.39,46.04
  Top 0.406: 72.39,46.04 C21.+
RXD0  (via drill 0.3)
  Top 0.152: v34.45,31.75 34.57,31.87 IC2.2 42.27,31.87 44.93,29.21 49.85,29.21 50.48,29.84 50.48,33.34 | 50.48,33.34 51.44,34.29 71.44,34.29 v71.44,35.4 | v73.34,35.4 73.34,36.51 IC3.9 | 50.48,33.34
  Bottom 0.152: ISP.4 27.94,17.78 27.94,19.68 28.57,20.32 30.48,20.32 31.11,20.95 31.11,23.5 33.97,26.35 33.97,31.43 34.29,31.75 v34.45,31.75 | v71.44,35.4 v73.34,35.4
RXD1  (via drill 0.3)
  Top 0.152: IC2.27 46.29,16.51 v82.87,16.51 | PDA.3 84.61,30.64 89.06,30.64 89.38,30.96 89.38,33.18 90.17,33.97 R15.1
  Bottom 0.152: v82.87,16.51 82.87,28.89 PDA.3
S0  (via drill 0.3)
  Top 0.152: IC2.44 54.03,29.47 v54.13,29.37
  Bottom 0.152: v54.13,29.37 53.98,29.37 53.34,28.73 53.34,11.91 53.82,11.43 57.15,11.43 RN2.2 SERVO_A.1
S1  (via drill 0.3)
  Top 0.152: IC2.45 53.87,30.27 v53.98,30.16
  Bottom 0.152: v53.98,30.16 53.02,29.21 53.02,11.59 53.5,11.11 54.93,11.11 RN2.3 SERVO_A.2
S2  (via drill 0.3)
  Top 0.152: IC2.46 54.02,31.07 v54.13,30.96
  Bottom 0.152: v54.13,30.96 53.98,30.96 52.7,29.69 52.7,10.79 RN2.4 SERVO_A.3
S3  (via drill 0.3)
  Top 0.152: IC2.47 53.85,31.87 v53.98,31.75
  Bottom 0.152: v53.98,31.75 | v53.98,31.75 52.39,30.16 52.39,11.75 RN2.5 SERVO_A.4
S4  (via drill 0.3)
  Top 0.152: IC2.48 54.01,32.67 v54.13,32.54
  Bottom 0.152: v54.13,32.54 53.98,32.54 52.07,30.64 52.07,12.7 49.53,10.16 RN2.6 SERVO_A.5
S5  (via drill 0.3)
  Top 0.152: IC2.49 50.29,33.78 50.16,33.66 50.16,30.48 v49.53,29.84
  Bottom 0.152: SERVO_A.6 RN2.7 45.72,22.07 46.2,22.54 47.94,22.54 48.9,23.5 48.9,29.21 v49.53,29.84
S6  (via drill 0.3)
  Top 0.152: IC2.50 49.49,30.92 v48.9,30.32 | v48.9,30.32
  Bottom 0.152: SERVO_A.7 RN2.8 44.45,10.16 45.4,11.11 45.4,22.23 46.04,22.86 47.78,22.86 48.58,23.65 48.58,29.37 48.9,29.69 v48.9,30.32
S7  (via drill 0.3)
  Top 0.152: IC2.51 48.69,30.91 48.26,30.48 v48.26,29.84
  Bottom 0.152: SERVO_A.8 RN2.9 41.91,10.16 42.86,11.11 44.77,11.11 45.09,11.43 45.09,22.38 45.88,23.18 47.62,23.18 48.26,23.81 v48.26,29.84
S8  (via drill 0.3)
  Top 0.152: IC2.17 38.26,18.9 38.26,18.57 v34.45,18.57
  Bottom 0.152: v34.45,18.57 33.97,18.1 33.97,11.75 RN1.2 SERVO_B.1
S9  (via drill 0.3)
  Top 0.152: IC2.16 34.64,20.67 v34.61,20.64
  Bottom 0.152: v34.61,20.64 34.29,20.64 33.66,20 33.66,10.79 RN1.3 SERVO_B.2
S10  (via drill 0.3)
  Top 0.152: IC2.15 34.49,21.47 v34.45,21.43
  Bottom 0.152: v34.45,21.43 34.61,21.59 | v34.45,21.43 | v34.45,21.43 33.34,20.32 33.34,11.75 31.75,10.16 RN1.4 SERVO_B.3
S11  (via drill 0.3)
  Top 0.152: IC2.14 34.65,22.27 v34.61,22.23
  Bottom 0.152: v34.61,22.23 34.29,22.23 33.02,20.95 33.02,12.06 32.07,11.11 28.89,11.11 RN1.5 SERVO_B.4
S12  (via drill 0.3)
  Top 0.152: IC2.12 34.66,23.87 v34.61,23.81
  Bottom 0.152: v34.61,23.81 34.29,23.81 32.38,21.91 32.38,12.7 31.43,11.75 24.45,11.75 RN1.7 SERVO_B.6
S14  (via drill 0.3)
  Top 0.152: IC2.10 34.68,25.47 v34.61,25.4
  Bottom 0.152: v34.61,25.4 34.29,25.4 31.75,22.86 31.75,13.65 30.48,12.38 20,12.38 RN1.9 SERVO_B.8
S15  (via drill 0.3)
  Top 0.152: IC2.13 34.5,23.07 v34.45,23.02
  Bottom 0.152: 34.61,23.18 v34.45,23.02 32.7,21.27 32.7,12.38 31.75,11.43 26.67,11.43 RN1.6 SERVO_B.5
S16  (via drill 0.3)
  Top 0.152: IC2.42 54.13,27.87 v54.13,27.78
  Bottom 0.152: v54.13,27.78 54.45,27.62 56.52,25.56 56.52,20.16 56.52,14.45 56.99,13.97 76.2,13.97 80.01,10.16 RN3.2 SERVO_C.1
S17  (via drill 0.3)
  Top 0.152: IC2.41 53.98,27.07 v53.98,26.99
  Bottom 0.152: v53.98,26.99 54.29,26.99 56.2,25.08 56.2,14.13 56.67,13.65 75.25,13.65 RN3.3 SERVO_C.2
S18  (via drill 0.3)
  Top 0.152: IC2.40 54.13,26.27 v54.13,26.19
  Bottom 0.152: 55.88,20.16 | 55.88,20.16 55.88,24.45 v54.13,26.19 | 55.88,20.16 55.88,13.81 56.36,13.34 73.03,13.34 RN3.4 SERVO_C.3
S19  (via drill 0.3)
  Top 0.152: IC2.39 53.98,25.47 v53.98,25.4
  Bottom 0.152: v53.98,25.4 54.29,25.4 55.56,24.13 55.56,20.16 55.56,13.49 56.04,13.02 70.8,13.02 RN3.5 SERVO_C.4
S20  (via drill 0.3)
  Top 0.152: IC2.37 53.98,23.87 v53.98,23.81
  Bottom 0.152: v53.98,23.81 54.29,23.81 54.93,23.18 54.93,12.86 55.4,12.38 66.36,12.38 RN3.7 SERVO_C.6
S21  (via drill 0.3)
  Top 0.152: IC2.36 54.13,23.07 v54.13,23.02
  Bottom 0.152: RN3.8 66.04,12.06 55.09,12.06 54.61,12.54 54.61,22.54 v54.13,23.02 | RN3.8 | RN3.8 SERVO_C.7
S22  (via drill 0.3)
  Top 0.152: IC2.35 53.98,22.27 v53.98,22.23
  Bottom 0.152: v53.98,22.23 54.29,21.91 54.29,12.22 54.77,11.75 60.64,11.75 61.91,11.75 RN3.9 SERVO_C.8
S23  (via drill 0.3)
  Top 0.152: IC2.38 54.13,24.67 v54.13,24.61
  Bottom 0.152: RN3.6 68.58,12.7 55.72,12.7 55.24,13.18 55.24,23.5 v54.13,24.61 | RN3.6 | RN3.6 SERVO_C.5
SCK  (via drill 0.3)
  Top 0.152: IC2.11 34.51,24.67 v34.45,24.61 | v34.45,24.61 34.29,24.45 | v34.45,24.61 | ISP.3 30.48,16.51 30.48,13.02 30.64,12.86 v31.75,12.86
  Bottom 0.152: 34.61,24.77 v34.45,24.61 32.07,22.23 32.07,13.18 v31.75,12.86 30.96,12.06 22.23,12.06 RN1.8 SERVO_B.7
SCL  (via drill 0.3)
  Top 0.152: IC2.25 44.69,15.88 66.99,15.88 v67.31,15.56 R10.2
  Bottom 0.152: I2C.5 67.31,18.1 v67.31,15.56
SDA  (via drill 0.3)
  Top 0.152: IC2.26 45.49,16.19 68.58,16.19 v69.22,15.56 R11.2
  Bottom 0.152: I2C.4 67.31,21.91 67.63,22.23 70.48,22.23 70.8,21.91 70.8,19.37 70.48,19.05 69.53,19.05 69.22,18.73 v69.22,15.56
TXD0  (via drill 0.3)
  Top 0.152: v34.61,30.96 34.72,31.07 IC2.3 42.43,31.07 44.61,28.89 50.01,28.89 50.8,29.69 50.8,33.18 | 50.8,33.18 51.59,33.97 72.07,33.97 72.07,36.51 IC3.11 | 50.8,33.18
  Bottom 0.152: ISP.1 30.8,13.97 31.43,14.61 31.43,23.18 34.29,26.04 34.29,30.64 v34.61,30.96
TXD1  (via drill 0.3)
  Top 0.152: IC2.28 47.09,16.83 81.92,16.83 v82.23,17.14 | R14.1 91.02,39.47 91.44,39.05 91.44,34.77 89.69,33.02 89.69,30.8 89.22,30.32 84.93,30.32 84.14,29.53 84.14,28.57 83.82,28.26 82.55,28.26 82.23,28.57 82.23,30.8 PDA.4
  Bottom 0.152: v82.23,17.14 82.23,30.8 PDA.4
UB_SENS  (via drill 0.3)
  Top 0.152: 21.59,33.34 v21.59,32.07 | v31.11,32.07 31.11,33.34 37.62,33.34 37.62,32.23 43.97,32.23 44.69,32.94 IC2.56
  Top 0.254: 21.59,33.34 R3.2 R1.1
  Bottom 0.152: v21.59,32.07 v31.11,32.07
USB_D+
  Bottom 0.406: X1.3 85.58,38.25 87,36.83 87,30.48 PDA.7
USB_D-
  Bottom 0.406: X1.2 84.72,36.25 85.72,35.24 PDA.6
USB_VBUS
  Bottom 0.406: X1.1 82.31,34.29 83.5,34.29 84.45,33.34 84.45,30.48 PDA.5
VC
  Top 0.254: 5.71,38.73 D2.C 5.51,38.1 | D3.C 5.51,38.1 | 16.51,37.47 14.61,37.47 13.97,38.1 5.51,38.1 | C8.+ 22.07,35.24 22.07,37.78 18.1,37.78 17.78,37.47 16.51,37.47 | 16.51,37.47 IC1.6
VCC  (via drill 0.3, 0.61)
  Top 0.152: 86.68,10.16 D4.C | 86.68,10.16 88.58,10.16 88.58,9.84 R13.2 R12.2 | 67.31,8.73 67.31,8.57 | 90.27,41.37 90.17,41.27 R14.2 90.17,41.12 89.06,41.12 89.06,38.1 | 89.06,38.1 89.06,37.62 90.17,37.62 R15.2 | R11.1 69.22,12.06 67.31,12.06 | R5.2 34.29,27.15 34.13,27.3 31.43,27.3 | 89.06,38.1 86.36,38.1 84.77,39.69 78.74,39.69 77.47,38.42 69.53,38.42 69.53,35.4 | 69.53,35.4 v68.9,35.4 68.9,36.96 | C17.2 67.68,25.08 v66.36,25.08 | IC3.15 69.53,36.96 69.53,35.4 | 68.9,36.96 68.9,36.83 | 68.9,36.96 IC3.16 | IC2.52 47.94,34.47 | RN3.1 86.68,10.16
  Top 0.254: 93.03,41.37 93.03,41.27 | 67.31,12.06 R10.1
  Top 0.406: LED2.A 93.03,41.37 LED1.A 90.27,41.37 | L1.1 28.89,34.29 v28.89,33.02
  Top 0.61: IC2.21 41.49,19.63 v41.27,20.16 41.12,20.32 37.94,20.32 37.31,19.68 32.07,19.68 31.43,20.32 | IC2.52 47.89,33.23 v47.94,33.18
  Top 0.813: U$4.4 26.35,30.04 C10.+ | RN3.1 83.82,8.73 67.31,8.73 | 60.96,8.73 67.31,8.73 | 60.96,8.73 RN2.1 | 38.1,8.73 60.96,8.73 | 38.1,8.73 RN1.1 | 38.1,8.73 26.67,8.73 ISP.2 27.94,15.24 27.94,20.32 31.43,20.32 31.43,27.3 31.43,31.11 28.89,31.11 | 28.89,31.11 27.3,31.11 | 67.31,8.73 67.31,12.06 | R10.1 67.09,12.17 66.99,12.06 66.52,12.06 64.77,13.81 v64.77,15.08 | 28.89,31.11 v28.89,33.02
  Top 1.016: 27.3,31.11 U$4.4
  Bottom 0.152: 68.9,36.99 v68.9,35.4
  Bottom 0.406: 41.27,21.59 C104.1
  Bottom 0.61: v47.94,33.18 47.94,31.75 C103.1 47.84,30.7 47.31,30.16 47.31,24.13 41.27,24.13 41.27,21.59 v41.27,20.16
  Bottom 0.813: v64.77,15.08 I2C.3 64.77,22.54 66.36,24.13 v66.36,25.08 66.36,36.99 68.9,36.99 C100.1 | v28.89,33.02 C107.1

### Text on the board
tPlace: + | - | RCMega128 (c)2005 | thomas.kindler@gmx.de